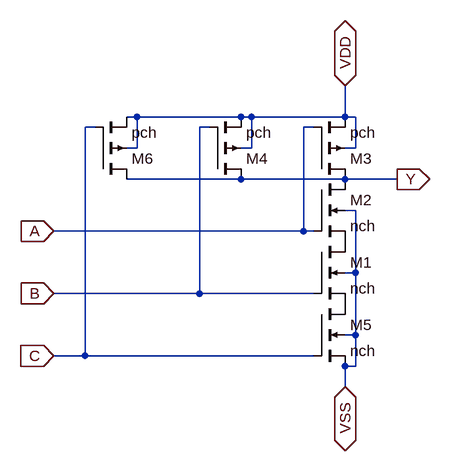
[diagram p0: schematic nand3.asc]
nand3.asc, the LTspice schematic file:
Version 4
SHEET 1 880 680
WIRE -80 -32 -96 -32
WIRE 80 -32 -80 -32
WIRE 96 -32 80 -32
WIRE 240 -32 240 -80
WIRE 240 -32 96 -32
WIRE 256 -32 240 -32
WIRE -144 -16 -160 -16
WIRE 32 -16 16 -16
WIRE 192 -16 176 -16
WIRE -80 16 -80 -32
WIRE -80 16 -96 16
WIRE 96 16 96 -32
WIRE 96 16 80 16
WIRE 256 16 256 -32
WIRE 256 16 240 16
WIRE 80 64 -96 64
WIRE 240 64 80 64
WIRE 320 64 240 64
WIRE 256 112 240 112
WIRE 176 144 176 -16
WIRE 176 144 -208 144
WIRE 192 144 176 144
WIRE 256 208 256 112
WIRE 256 208 240 208
WIRE 16 240 16 -16
WIRE 16 240 -208 240
WIRE 192 240 16 240
WIRE 256 304 256 208
WIRE 256 304 240 304
WIRE -160 336 -160 -16
WIRE -160 336 -208 336
WIRE 192 336 -160 336
WIRE 256 352 256 304
WIRE 256 352 240 352
WIRE 240 384 240 352
FLAG -208 144 A
IOPIN -208 144 In
FLAG -208 240 B
IOPIN -208 240 In
FLAG 320 64 Y
IOPIN 320 64 Out
FLAG -208 336 C
IOPIN -208 336 In
FLAG 240 384 VSS
IOPIN 240 384 BiDir
FLAG 240 -80 VDD
IOPIN 240 -80 BiDir
SYMBOL nmos4 192 160 R0
SYMATTR InstName M1
SYMATTR Value nch
SYMATTR Value2 l=ln w=wn
SYMBOL nmos4 192 64 R0
SYMATTR InstName M2
SYMATTR Value nch
SYMATTR Value2 l=ln w=wn
SYMBOL pmos4 192 64 M180
SYMATTR InstName M3
SYMATTR Value pch
SYMATTR Value2 l=lp w=wp
SYMBOL pmos4 32 64 M180
SYMATTR InstName M4
SYMATTR Value pch
SYMATTR Value2 l=lp w=wp
SYMBOL nmos4 192 256 R0
SYMATTR InstName M5
SYMATTR Value nch
SYMATTR Value2 l=ln w=wn
SYMBOL pmos4 -144 64 M180
SYMATTR InstName M6
SYMATTR Value pch
SYMATTR Value2 l=lp w=wp

The netlist it stands for:
* nand3.asc
M1 P001 B P002 VSS nch l=ln w=wn
M2 Y A P001 VSS nch l=ln w=wn
M3 Y A VDD VDD pch l=lp w=wp
M4 Y B VDD VDD pch l=lp w=wp
M5 P002 C VSS VSS nch l=ln w=wn
M6 Y C VDD VDD pch l=lp w=wp
.model NMOS NMOS
.model PMOS PMOS
.lib standard.mos
.backanno
.end